# Altium schematic sheet power.SchDoc
size A3
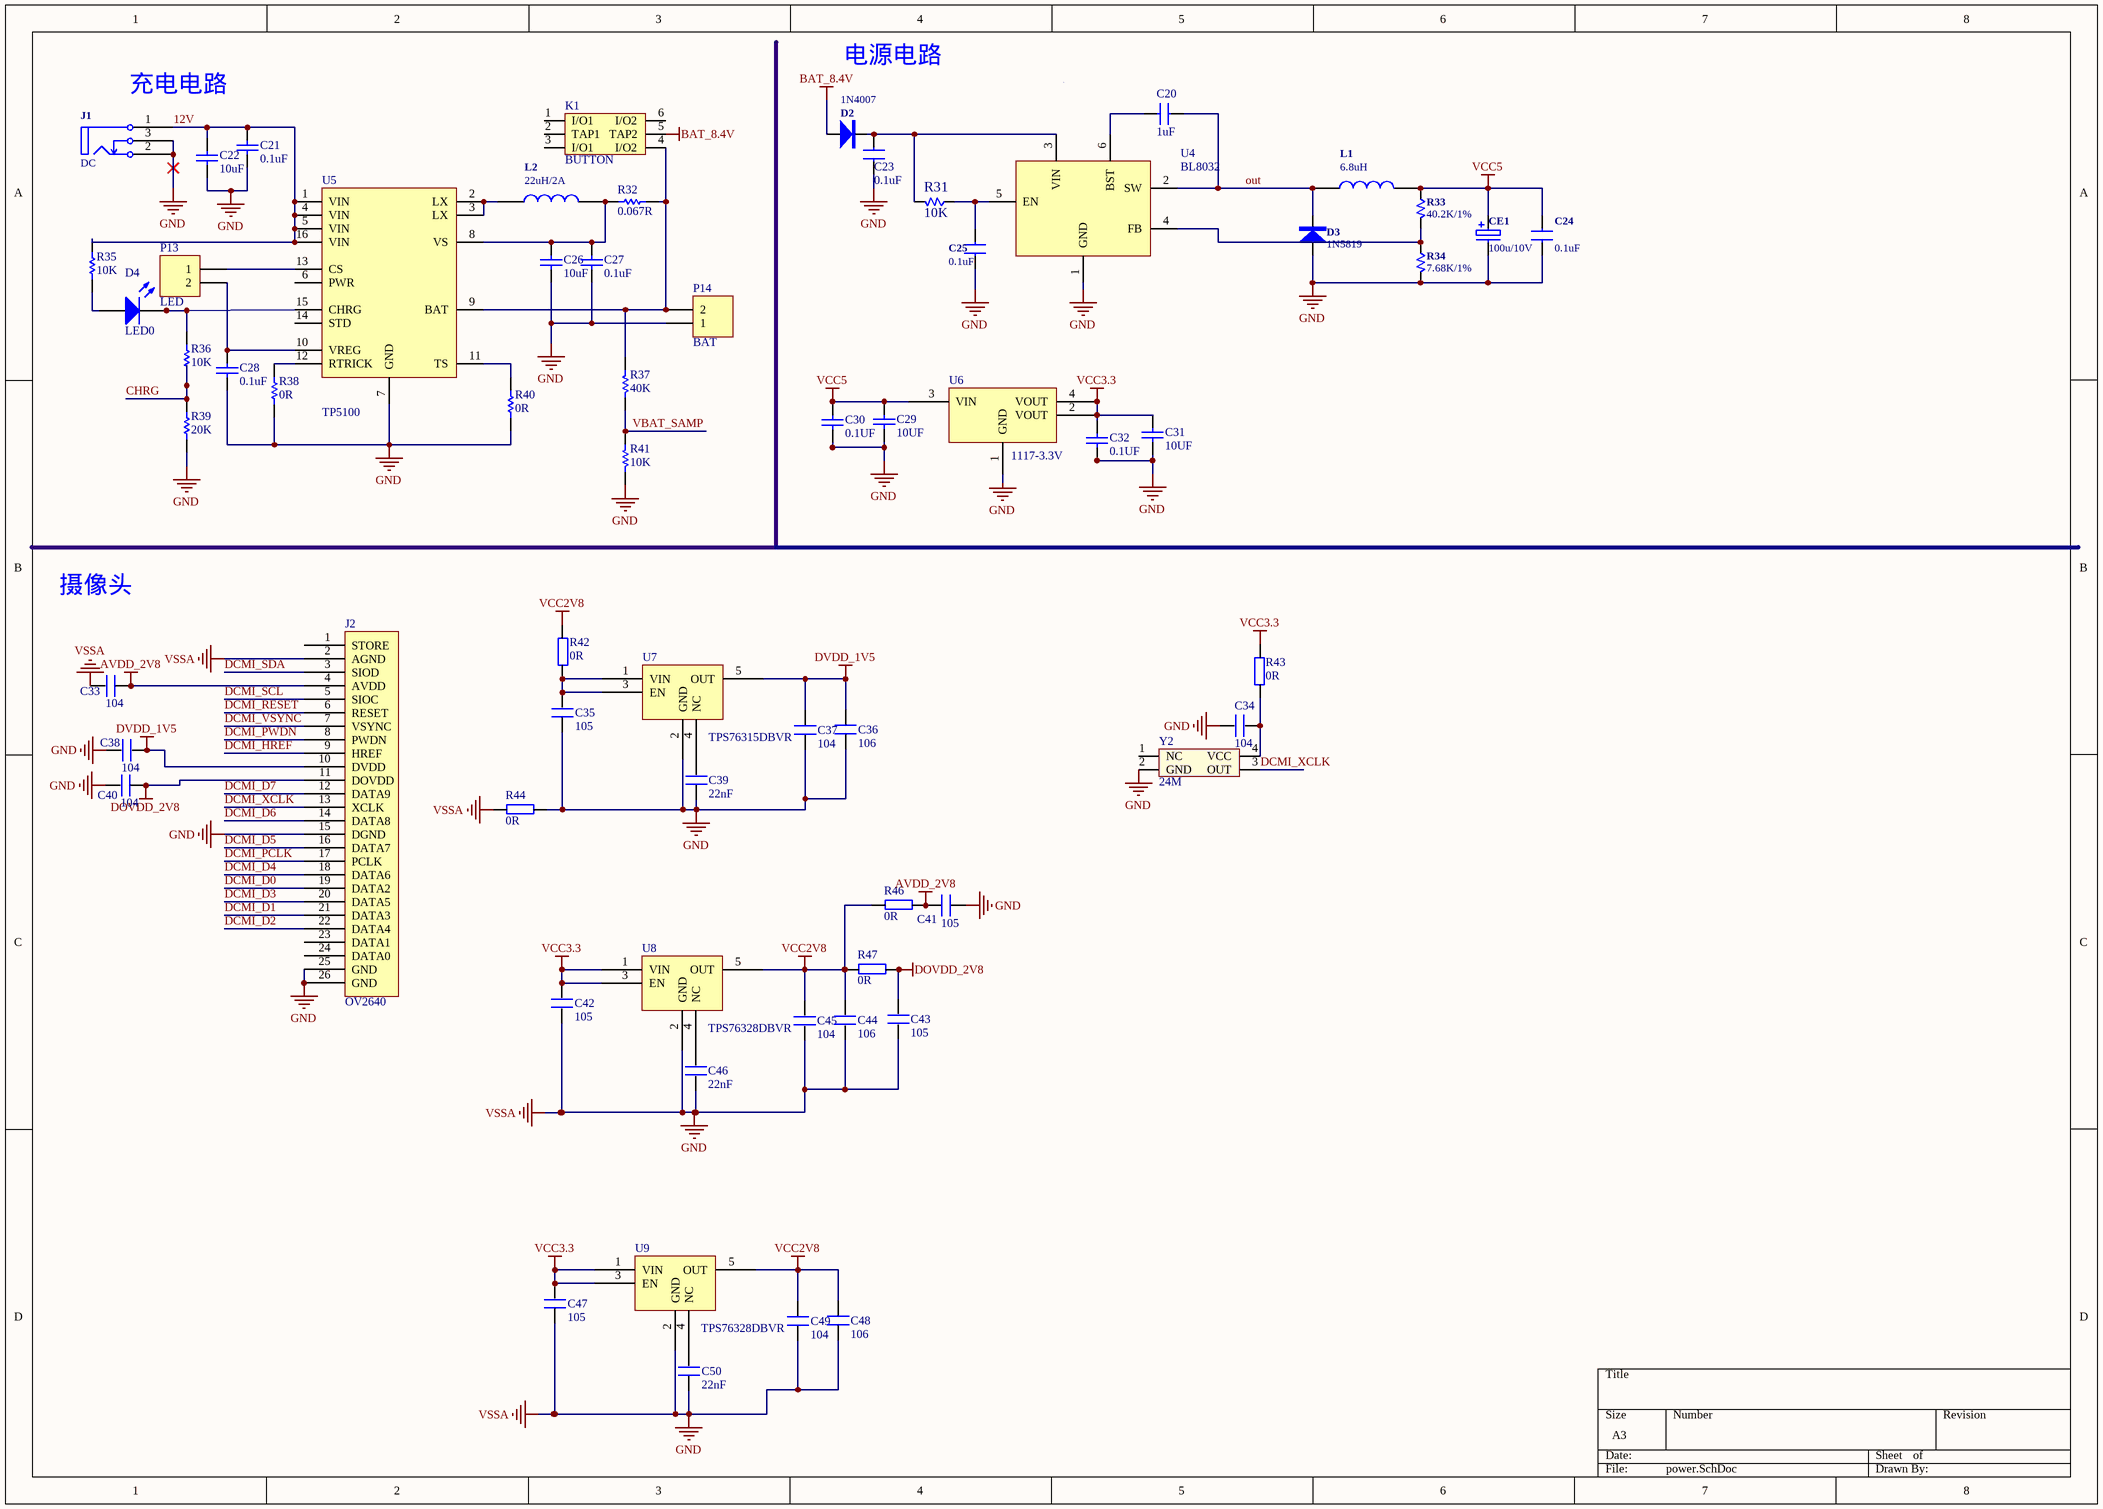
[diagram p0: power.SchDoc]

## Parts
C20  1uF  [0603c]
C21  0.1uF  [0603C]
C22  10uF  [0805C]
C23  0.1uF  [C0603]
C24  0.1uF  [C0603]
C25  0.1uF  [C0603]
C26  10uF  [0603C]
C27  0.1uF  [0603C]
C28  0.1uF  [0603C]
C29  value 10UF  [0603C]  (hidden comment: Cap)
C30  value 0.1UF  [0603C]  (hidden comment: Cap)
C31  value 10UF  [0603C]  (hidden comment: Cap)
C32  value 0.1UF  [0603C]  (hidden comment: Cap)
C33  104  [0603P]
C34  104  [0603P]
C35  105  [0603P]
C36  106  [0603P]
C37  104  [0603P]
C38  104  [0603P]
C39  22nF  [0603P]
C40  104  [0603P]
C41  105  [0603P]
C42  105  [0603P]
C43  105  [0603P]
C44  106  [0603P]
C45  104  [0603P]
C46  22nF  [0603P]
C47  105  [0603P]
C48  106  [0603P]
C49  104  [0603P]
C50  22nF  [0603P]
CE1  100u/10V  [C_195]
D2  1N4007  [DO-214AC]
D3  1N5819  [DO-214AC]
D4  LED0  [0603LED]
J1  DC  [dc5V]
J2  OV2640  [OV2640]
K1  BUTTON  [BTN8.5*8.5]
L1  6.8uH  [WE_PD]
L2  22uH/2A  [WE_PD]
P13  LED  [SIP2]
P14  BAT  [CON2]
R31  10K  [R0603]
R32  0.067R  [1206]
R33  40.2K/1%  [R0603]
R34  7.68K/1%  [R0603]
R35  10K  [0603C]
R36  10K  [0603C]
R37  40K  [0603R]
R38  0R  [0603C]
R39  20K  [0603C]
R40  0R  [0603R]
R41  10K  [0603R]
R42  0R  [0603P]
R43  0R  [0603P]
R44  0R  [0603P]
R46  0R  [0603P]
R47  0R  [0603P]
U4  BL8032  [SOT23-6]
U5  TP5100  [QFN16(4*4)]
U6  1117-3.3V  [SOT223]
U7  TPS76315DBVR  [TPS763]
U8  TPS76328DBVR  [TPS763]
U9  TPS76328DBVR  [TPS763]
Y2  24M  [XTAL_S]

## Nets
AVDD_2V8: C33.1 C41.1 J2.4(AVDD) R46.1
BAT_8.4V: D2.1(A) K1.5(TAP2)
DOVDD_2V8: C40.1 C43.2 J2.11(DOVDD) R47.1
DVDD_1V5: C36.2 C37.2 C38.1 J2.10(DVDD) U7.5(OUT)
GND: C21.1 C22.2 C23.2 C24.2 C25.2 C26.1 C27.1 C28.1 C29.2 C30.2 C31.2 C32.2 C33.2 C34.2 C35.1 C36.1 C37.1 C38.2 C39.1 C40.2 C41.2 C42.1 C43.1 C44.1 C45.1 C46.1 C47.1 C48.1 C49.1 C50.1 CE1.2 D3.1(A) J1.2 J1.3 J2.2(AGND) J2.15(DGND) J2.25(GND) J2.26(GND) P14.1 R34.2 R38.1 R39.1 R40.1 R41.2 R44.1 R44.2 U4.1(GND) U5.7(GND) U6.1(GND) U7.2(GND) U8.2(GND) U9.2(GND) Y2.2(GND)  [also labelled VSSA]
VCC2V8: C44.2 C45.2 C48.2 C49.2 R42.2 R46.2 R47.2 U8.5(OUT) U9.5(OUT)
VCC3.3: C31.1 C32.1 C42.2 C47.2 R43.1 U6.2(VOUT) U6.4(VOUT) U8.1(VIN) U8.3(EN) U9.1(VIN) U9.3(EN)
VCC5: C24.1 C29.1 C30.1 CE1.1 L1.2 R33.1 U6.3(VIN)
12V: C21.2 C22.1 J1.1 R35.2 U5.1(VIN) U5.4(VIN) U5.5(VIN) U5.16(VIN)
CHRG: R36.1 R39.2
DCMI_D0: J2.19(DATA2)
DCMI_D1: J2.21(DATA3)
DCMI_D2: J2.22(DATA4)
DCMI_D3: J2.20(DATA5)
DCMI_D4: J2.18(DATA6)
DCMI_D5: J2.16(DATA7)
DCMI_D6: J2.14(DATA8)
DCMI_D7: J2.12(DATA9)
DCMI_HREF: J2.9(HREF)
DCMI_PCLK: J2.17(PCLK)
DCMI_PWDN: J2.8(PWDN)
DCMI_RESET: J2.6(RESET)
DCMI_SCL: J2.5(SIOC)
DCMI_SDA: J2.3(SIOD)
DCMI_VSYNC: J2.7(VSYNC)
DCMI_XCLK: J2.13(XCLK) Y2.3(OUT)
out: C20.2 D3.2(K) L1.1 U4.2(SW)
VBAT_SAMP: R37.2 R41.1
NetC20_1: C20.1 U4.6(BST)
NetC23_1: C23.1 D2.2(K) R31.2 U4.3(VIN)
NetC25_1: C25.1 R31.1 U4.5(EN)
NetC26_2: C26.2 C27.2 L2.2 R32.2 U5.8(VS)
NetC28_2: C28.2 P13.2 U5.10(VREG)
NetC34_1: C34.1 R43.2 Y2.4(VCC)
NetC35_2: C35.2 R42.1 U7.1(VIN) U7.3(EN)
NetC39_2: C39.2 U7.4(NC)
NetC46_2: C46.2 U8.4(NC)
NetC50_2: C50.2 U9.4(NC)
NetD4_1: D4.1(A) R35.1
NetD4_2: D4.2(K) R36.2 U5.15(CHRG)
NetK1_4: K1.4(I/O2) P14.2 R32.1 R37.1 U5.9(BAT)
NetL2_1: L2.1 U5.2(LX) U5.3(LX)
NetP13_1: P13.1 U5.13(CS)
NetR33_2: R33.2 R34.1 U4.4(FB)
NetR38_2: R38.2 U5.12(RTRICK)
NetR40_2: R40.2 U5.11(TS)

Not connected (* = marked no-connect by the designer): J2 1(STORE) 23(DATA1) 24(DATA0); K1 1(I/O1) 2(TAP1) 3(I/O1) 6(I/O2); U5 6(PWR) 14(STD); Y2 1(NC)

## Notes on the sheet
- (near J1) 充电电路
- 电源电路
- 摄像头

## Library data of the parts
C20 C23-C25 = CAP: Capacitor; IC: *
C21 C26-C28 = CAP: Capacitor; Value: 100pF; Published: 8-Jun-2000; Revision: July-2002: Re-released for DXP Platform.; Publisher: Altium Limited
C22 = Cap: Capacitor; Value: 4.7uF; Published: 8-Jun-2000; LatestRevisionDate: 17-Jul-2002; LatestRevisionNote: Re-released for DXP Platform.; PackageReference: RAD-0.3; Publisher: Altium Limited
C29-C32 = Cap: Capacitor; Published: 8-Jun-2000; LatestRevisionDate: 17-Jul-2002; LatestRevisionNote: Re-released for DXP Platform.; PackageReference: RAD-0.3; Publisher: Altium Limited; PackageDescription: Radial Cap, Thru-Hole; 2 Leads; 0.3 in Pin Spacing
C33-C50 = C
CE1 = CE
D2 D3 = D: Diode
D4 = LED0: Typical INFRARED GaAs LED; Published: 8-Jun-2000; LatestRevisionDate: 08-Jul-2005; LatestRevisionNote: Mech Layer 1 removed.; PackageReference: LED-0; Publisher: Altium Limited; PackageDescription: LED; 2 Leads
J1 = POWERCON
L1 L2 = INDUCTOR
P13 P14 = Header 2: Header, 2-Pin; LatestRevisionDate: 17-Jul-2002; LatestRevisionNote: Re-released for DXP Platform.; Publisher: Altium Limited
R31 R33 R34 = R: Resistor
R32 R35 R36 R38-R40 = Res1: Resistor; Value: 1K; Published: 8-Jun-2000; LatestRevisionDate: 17-Jul-2002; LatestRevisionNote: Re-released for DXP Platform.; PackageReference: AXIAL-0.3; Publisher: Altium Limited
R37 R41 = res1: Resistor; Value: 1K; Published: 8-Jun-2000; Revision: July-2002: Re-released for DXP Platform.; Publisher: Altium Limited
R42-R44 R46 R47 = R
U4 = BL8032: Diode Bridge
U5 = TP5100: Capacitor; Value: 4.7uF; Published: 8-Jun-2000; LatestRevisionDate: 17-Jul-2002; LatestRevisionNote: Re-released for DXP Platform.; PackageReference: RAD-0.3; Publisher: Altium Limited
U6 = 1117: LDO; Published: 8-Jun-2000; LatestRevisionDate: 17-Jul-2002; LatestRevisionNote: Re-released for DXP Platform.; PackageReference: POLAR0.8; Publisher: Altium Limited
U7 = TPS763  SOT23-5
U8 U9 = TPS763  SOT23-5: TPS76315DBVR
Y2 = XTAL_S